# Altium schematic sheet TopLevelDesign.SchDoc
size B; SheetNumber: 2; SheetTotal: 6
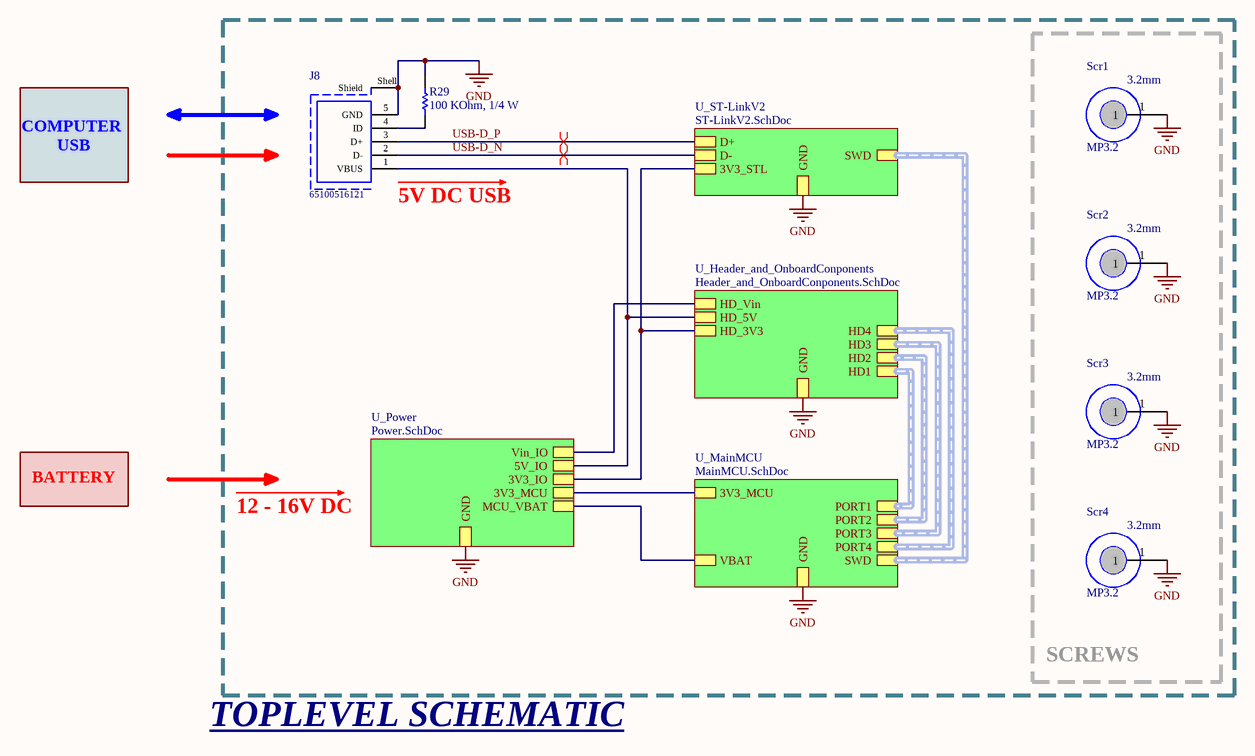
[diagram p0: TopLevelDesign.SchDoc]

## Parts
J8  65100516121  [65100516121]
R29  value 100 KOhm, 1/4 W  [resistor_0603]  (hidden comment: 0006031041)
Scr1  MP3.2  [MP3.2]
Scr2  MP3.2  [MP3.2]
Scr3  MP3.2  [MP3.2]
Scr4  MP3.2  [MP3.2]

## Blocks framed on the sheet
SCREWS: Scr1-Scr4

## Sub-sheets
U_Header_and_OnboardConponents = Header_and_OnboardConponents.SchDoc: HD_5V, HD_3V3, HD4 (harness HEADER4), HD3 (harness HEADER3), HD2 (harness HEADER2), HD1 (harness HEADER1), GND, HD_Vin
U_MainMCU = MainMCU.SchDoc: VBAT, PORT4 (harness PORT4), PORT3 (harness PORT3), PORT2 (harness PORT2), PORT1 (harness PORT1), SWD (harness MCU-SWD), 3V3_MCU, GND
U_Power = Power.SchDoc: Vin_IO, 5V_IO, 3V3_IO, 3V3_MCU, MCU_VBAT, GND
U_ST-LinkV2 = ST-LinkV2.SchDoc: D-, D+, 3V3_STL, SWD (harness STLINK-SWD), GND

## Nets
GND: J8.5(GND) J8.Shell(Shield) R29.2 Scr1.1 Scr2.1 Scr3.1 Scr4.1 ; sheet U_Power/GND, sheet U_MainMCU/GND, sheet U_ST-LinkV2/GND, sheet U_Header_and_OnboardConponents/GND
USB-D_N: J8.2(D-) ; sheet U_ST-LinkV2/D-
USB-D_P: J8.3(D+) ; sheet U_ST-LinkV2/D+
NetJ8_1: J8.1(VBUS) ; sheet U_Power/5V_IO, sheet U_Header_and_OnboardConponents/HD_5V
NetJ8_4: J8.4(ID) R29.1
(unnamed): sheet U_Power/Vin_IO, sheet U_Header_and_OnboardConponents/HD_Vin
(unnamed): sheet U_Power/3V3_IO, sheet U_ST-LinkV2/3V3_STL, sheet U_Header_and_OnboardConponents/HD_3V3
(unnamed): sheet U_Power/3V3_MCU, sheet U_MainMCU/3V3_MCU
(unnamed): sheet U_Power/MCU_VBAT, sheet U_MainMCU/VBAT

## Buses and harness runs
harness sheet U_Header_and_OnboardConponents/HD1 = sheet U_MainMCU/PORT1
harness sheet U_Header_and_OnboardConponents/HD2 = sheet U_MainMCU/PORT2
harness sheet U_Header_and_OnboardConponents/HD3 = sheet U_MainMCU/PORT3
harness sheet U_Header_and_OnboardConponents/HD4 = sheet U_MainMCU/PORT4
harness sheet U_MainMCU/SWD = sheet U_ST-LinkV2/SWD

## Layout directives
differential pair: USB-D_N, USB-D_P

## Notes on the sheet
- COMPUTER
  USB
- (near J8) 5V DC USB
- BATTERY
- 12 - 16V DC
- TOPLEVEL SCHEMATIC
- (in symbol CMP-143-000000-1) 3.2mm

## Library data of the parts
J8 = CMP-111-000033-1: Mini USB 2.0 Type B Receptacle WR-COM, Horizontal, SMT, with Pads and Pegs; Contact Resistance: 20 mOhm; Working Voltage: 30 VAC; Rated Current: 1 A; Supplier 1 SN: 710-65100516121; ComponentLink2Description: Supplier 1 URL; Packaging: Tape and Reel; ComponentLink3Description: Supplier 2 URL; Gender: Receptacle; Supplier 3 Name: thegioiic; Component Type: Standard; Operating Temperature: -40 to 105 degC; Part Number: 65100516121; Mounting Technology: SMT; ComponentLink4Description: Supplier 3 URL; Design Item ID: 65100516121; ComponentLink4URL: N/A; Value: Mini USB 2.0 Type B; Supplier 3 URL: N/A; Pin Count: 6; Source: USB Connectors WR-COM.SchLib; Supplier 1 URL: https://www.mouser.vn/ProductDetail/Wurth-Elektronik/65100516121?qs=rS3zZhy2AQPLyCguT204Og%3D%3D; Supplier 3 SN: N/A; Supplier 2 SN: N/A; ComponentLink2URL: N/A; Publisher: Wurth Elektronik; Supplier 2 URL: N/A; ComponentLink1Description: Datasheet; Supplier 1 Name: Mouser; ComponentLink1URL: https://katalog.we-online.de/em/datasheet/65100516121.pdf; Orientation: Horizontal; ComponentLink3URL: N/A; Connector Type: Mini USB 2.0 Type B; Supplier 2 Name: Digi-Key; Published Date: September 2018
R29 = CMP-009-00189-1: RES, size 0603, 100 KOhm, 1/4 W; Manufacture  SN: OEM; Resistance Tolerance: +/-1%; Rated Power: 1/4 W; Supplier 1 SN: 603-SR0603FR-7T100KL; Supplier 3 URL: N/A; Component Type: Standard; ComponentLink3Description: Supplier 2 URL; ComponentLink1URL: https://www.yageo.com/upload/media/product/productsearch/datasheet/rchip/PYu-SR_20105_RoHS_L_10.pdf; ComponentLink2URL: N/A; Supplier 2 Name: Digi-Key; Design Item ID: 0006031041; ComponentLink4URL: N/A; Supplier 2 SN: YAG5821TR-ND YAG5821CT-ND YAG5821DKR-ND; ComponentLink4Description: Supplier 3 URL; Supplier 1 URL: https://www.mouser.vn/ProductDetail/YAGEO/SR0603FR-7T100KL?qs=sGAEpiMZZMvdGkrng054tz1y1XEHv7sNa%252BA%2F4WiDMf7aGw4zRBb%2FFQ%3D%3D; ComponentLink1Description: Datasheet link; Supplier 3 SN: N/A; Supplier 2 URL: https://www.digikey.com/en/products/detail/yageo/SR0603FR-7T100KL/9373095; ComponentLink3URL: https://www.digikey.com/en/products/detail/yageo/SR0603FR-7T100KL/9373095; ComponentLink2Description: Supplier 1 URL; Source: Resistor_0603.SchLib; Supplier 3 Name: thegioiic; Manufacture  Name: OEM; Pins: 2; Size: 0603; Supplier 1 Name: Mouser; Mounting Technology: SMT
Scr1-Scr4 = CMP-143-000000-1: Component Type: Standard; Pin Count: 1; Source: MP_3P2.SchLib; Design Item ID: MP3.2